# Altium project SewingAutoExt.PrjPcb
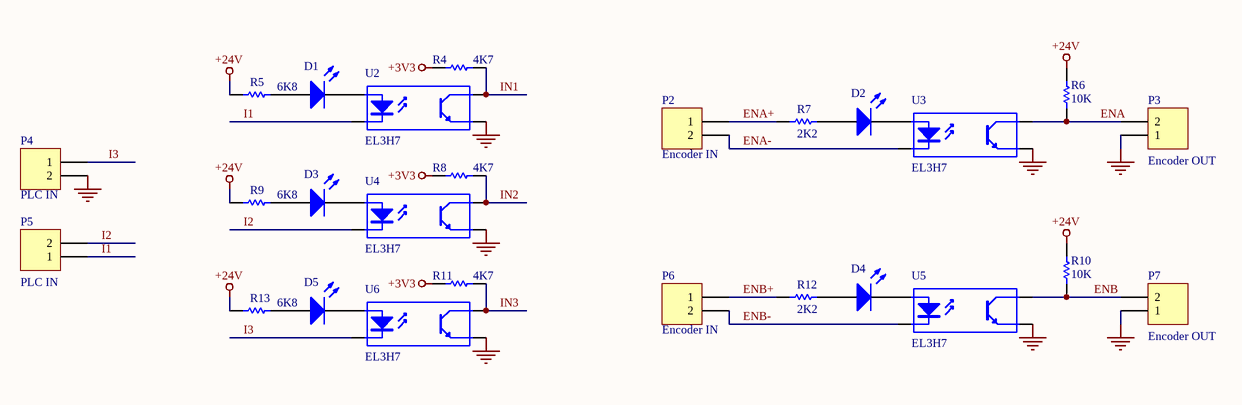
[diagram p0: InputLevelShifter.SchDoc]
4 sheets, 58 parts. Net scope: global (net labels, ports and power ports of the same name join across sheets).
Board file: SewingAutoExt.PcbDoc
Sheets:
  InputLevelShifter.SchDoc
  MCU.SchDoc
  PowerSupply.SchDoc
  DACAmplification.SchDoc

## Sheet InputLevelShifter.SchDoc
size A4

### Parts
D1  SMD0805-RED  [LED-0805]  (value not drawn)
D2  SMD0805-RED  [LED-0805]  (value not drawn)
D3  SMD0805-RED  [LED-0805]  (value not drawn)
D4  SMD0805-RED  [LED-0805]  (value not drawn)
D5  SMD0805-RED  [LED-0805]  (value not drawn)
P2  value Encoder IN  [TER-KF128-2P]  (hidden comment: KF128-2P)
P3  value Encoder OUT  [TER-KF128-2P]  (hidden comment: KF128-2P)
P4  value PLC IN  [TER-KF128-2P]  (hidden comment: KF128-2P)
P5  value PLC IN  [TER-KF128-2P]  (hidden comment: KF128-2P)
P6  value Encoder IN  [TER-KF128-2P]  (hidden comment: KF128-2P)
P7  value Encoder OUT  [TER-KF128-2P]  (hidden comment: KF128-2P)
R4  4K7  [R-0805]
R5  6K8  [R-0805]
R6  10K  [R-0805]
R7  2K2  [R-0805]
R8  4K7  [R-0805]
R9  6K8  [R-0805]
R10  10K  [R-0805]
R11  4K7  [R-0805]
R12  2K2  [R-0805]
R13  6K8  [R-0805]
U2  EL3H7  [SSOP-4]
U3  EL3H7  [SSOP-4]
U4  EL3H7  [SSOP-4]
U5  EL3H7  [SSOP-4]
U6  EL3H7  [SSOP-4]

### Nets
+3V3: R4.2 R8.2 R11.2
+24V: R5.1 R6.2 R9.1 R10.2 R13.1
GND: P3.1 P4.2 P7.1 U2.3(E) U3.3(E) U4.3(E) U5.3(E) U6.3(E)
ENA: P3.2 R6.1 U3.4(C)
ENA+: P2.1 R7.1
ENA-: P2.2 U3.2(K)
ENB: P7.2 R10.1 U5.4(C)
ENB+: P6.1 R12.1
ENB-: P6.2 U5.2(K)
I1: P5.1 U2.2(K)
I2: P5.2 U4.2(K)
I3: P4.1 U6.2(K)
IN1: R4.1 U2.4(C)
IN2: R8.1 U4.4(C)
IN3: R11.1 U6.4(C)
NetD1_1: D1.1(A) R5.2
NetD1_2: D1.2(K) U2.1(A)
NetD2_1: D2.1(A) R7.2
NetD2_2: D2.2(K) U3.1(A)
NetD3_1: D3.1(A) R9.2
NetD3_2: D3.2(K) U4.1(A)
NetD4_1: D4.1(A) R12.2
NetD4_2: D4.2(K) U5.1(A)
NetD5_1: D5.1(A) R13.2
NetD5_2: D5.2(K) U6.1(A)

### Library data of the parts
D1-D5 = LED0: Typical INFRARED GaAs LED; Value: StatusLed; Published: 8-Jun-2000; LatestRevisionDate: 08-Jul-2005; LatestRevisionNote: Mech Layer 1 removed.; PackageReference: LED-0
P2-P7 = Header 2: Header, 2-Pin; LatestRevisionDate: 17-Jul-2002; LatestRevisionNote: Re-released for DXP Platform.
R4-R13 = Res1: Resistor; Published: 8-Jun-2000; LatestRevisionDate: 17-Jul-2002; LatestRevisionNote: Re-released for DXP Platform.; PackageReference: AXIAL-0.3; Publisher: Altium Limited; PackageDescription: Axial Device, Thru-Hole; 2 Leads; 0.3 in Pin Spacing
  R4 R8 R11: Value: 4K7
  R5 R9 R13: Value: 6K8
  R6 R10: Value: 10K
  R7 R12: Value: 2K2
U2-U6 = Optoisolator1: 4-Pin Phototransistor Optocoupler; Published: 24-Mar-1999; LatestRevisionDate: 04-Mar-2005; LatestRevisionNote: Sch pins 3 & 4 Swapped.; DatasheetDocument: Nov-2003; PackageReference: DIP-4; Value: EL3H7

## Sheet MCU.SchDoc
size A4
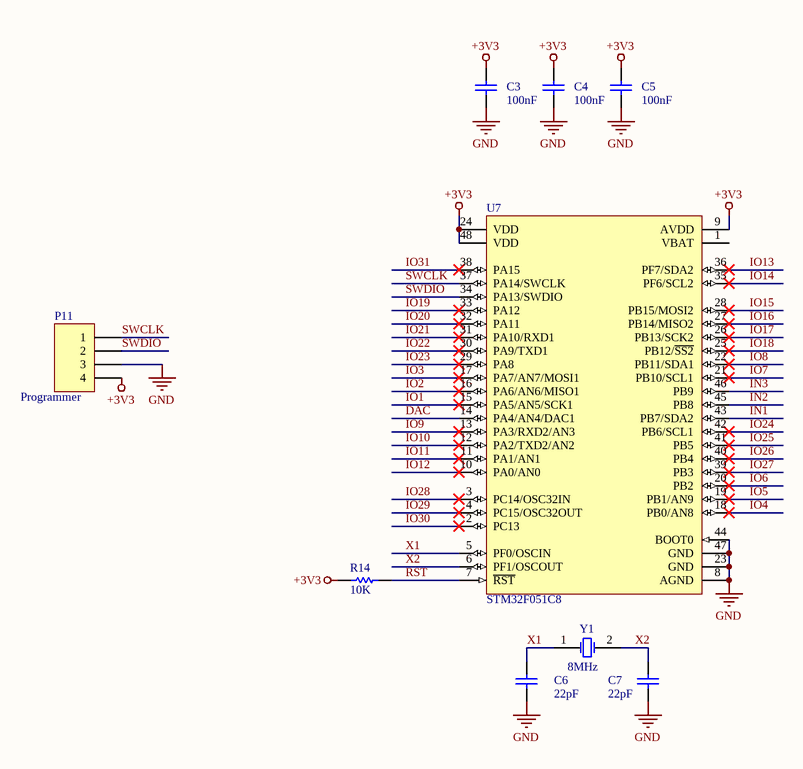
[diagram p1: MCU.SchDoc]

### Parts
C3  value 100nF  [C-0805]  (hidden comment: 104)
C4  value 100nF  [C-0805]  (hidden comment: 104)
C5  value 100nF  [C-0805]  (hidden comment: 104)
C6  value 22pF  [C-0805]  (hidden comment: 22)
C7  value 22pF  [C-0805]  (hidden comment: 22)
P11  value Programmer  [JP2.54-M-1x04A]  (hidden comment: JP2.54-M-4P)
R14  10K  [R-0805]
U7  STM32F051C8  [LQFP-48]
Y1  8MHz  [XTAL-49S]

### Nets
+3V3: C3.1 C4.1 C5.1 P11.4 R14.2 U7.9(AVDD) U7.24(VDD) U7.48(VDD)
GND: C3.2 C4.2 C5.2 C6.1 C7.1 P11.3 U7.8(AGND) U7.23(GND) U7.44(BOOT0) U7.47(GND)
DAC: U7.14(PA4/AN4/DAC1)
IN1: U7.43(PB7/SDA2)
IN2: U7.45(PB8)
IN3: U7.46(PB9)
IO1: U7.15(PA5/AN5/SCK1)
IO2: U7.16(PA6/AN6/MISO1)
IO3: U7.17(PA7/AN7/MOSI1)
IO4: U7.18(PB0/AN8)
IO5: U7.19(PB1/AN9)
IO6: U7.20(PB2)
IO7: U7.21(PB10/SCL1)
IO8: U7.22(PB11/SDA1)
IO9: U7.13(PA3/RXD2/AN3)
IO10: U7.12(PA2/TXD2/AN2)
IO11: U7.11(PA1/AN1)
IO12: U7.10(PA0/AN0)
IO13: U7.36(PF7/SDA2)
IO14: U7.35(PF6/SCL2)
IO15: U7.28(PB15/MOSI2)
IO16: U7.27(PB14/MISO2)
IO17: U7.26(PB13/SCK2)
IO18: U7.25(PB12/~{SS2})
IO19: U7.33(PA12)
IO20: U7.32(PA11)
IO21: U7.31(PA10/RXD1)
IO22: U7.30(PA9/TXD1)
IO23: U7.29(PA8)
IO24: U7.42(PB6/SCL1)
IO25: U7.41(PB5)
IO26: U7.40(PB4)
IO27: U7.39(PB3)
IO28: U7.3(PC14/OSC32IN)
IO29: U7.4(PC15/OSC32OUT)
IO30: U7.2(PC13)
IO31: U7.38(PA15)
RST: R14.1 U7.7(~{RST})
SWCLK: P11.1 U7.37(PA14/SWCLK)
SWDIO: P11.2 U7.34(PA13/SWDIO)
X1: C6.2 U7.5(PF0/OSCIN) Y1.1(OSC1)
X2: C7.2 U7.6(PF1/OSCOUT) Y1.2(OSC2)

Not connected (* = marked no-connect by the designer): U7 1(VBAT)

### Library data of the parts
C3-C7 = Cap: Capacitor; Published: 8-Jun-2000; LatestRevisionDate: 17-Jul-2002; LatestRevisionNote: Re-released for DXP Platform.; PackageReference: RAD-0.3; Publisher: Altium Limited
  C6 C7: PackageDescription: Radial Cap, Thru-Hole; 2 Leads; 0.3 in Pin Spacing
P11 = Header 4: Header, 4-Pin; LatestRevisionDate: 17-Jul-2002; LatestRevisionNote: Re-released for DXP Platform.
R14 = Res1: Resistor; Published: 8-Jun-2000; LatestRevisionDate: 17-Jul-2002; LatestRevisionNote: Re-released for DXP Platform.; PackageReference: AXIAL-0.3; Publisher: Altium Limited; PackageDescription: Axial Device, Thru-Hole; 2 Leads; 0.3 in Pin Spacing; Value: 10K
U7 = STM32F051C8: Core: ARM® 32-bit Cortex® -M0 CPU, frequency up to 48 MHz; Value: STM32F051C8
Y1 = XTAL: Crystal Oscillator; Published: 8-Jun-2000; LatestRevisionDate: 17-Jul-2002; LatestRevisionNote: Re-released for DXP Platform.; PackageReference: R38; Value: 8MHz; PackageDescription: Crystal, Thru-Hole; 2 Leads; Body 3.1 x 8.2 mm (Dia.xH)

## Sheet PowerSupply.SchDoc
size A4
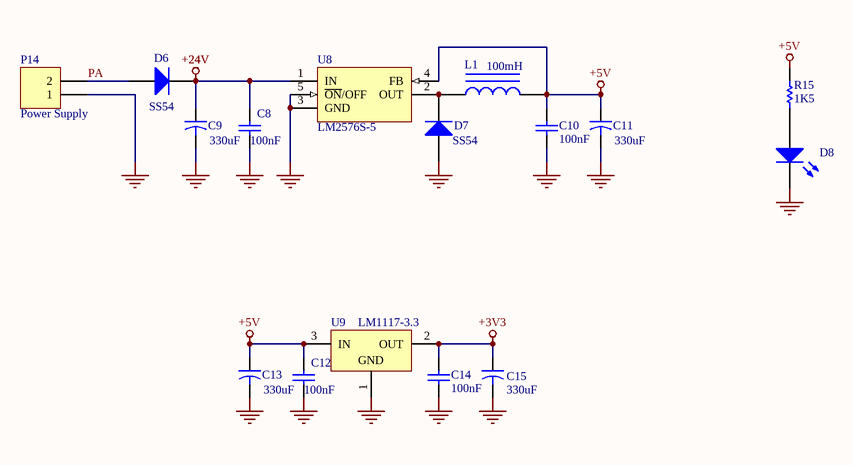
[diagram p2: PowerSupply.SchDoc]

### Parts
C8  value 100nF  [C-0805]  (hidden comment: 104)
C9  value 330uF  [C-ALU-10x10.2mm]  (hidden comment: 330uF/50V)
C10  value 100nF  [C-0805]  (hidden comment: 104)
C11  value 330uF  [C-ALU-10x10.2mm]  (hidden comment: 330uF/50V)
C12  value 100nF  [C-0805]  (hidden comment: 104)
C13  value 330uF  [C-ALU-10x10.2mm]  (hidden comment: 330uF/50V)
C14  value 100nF  [C-0805]  (hidden comment: 104)
C15  value 330uF  [C-ALU-10x10.2mm]  (hidden comment: 330uF/50V)
D6  value SS54  [D-DO214-AB]  (hidden comment: SS54-SMA)
D7  value SS54  [D-DO214-AB]  (hidden comment: SS54-SMA)
D8  SMD0805-RED  [LED-0805]  (value not drawn)
L1  value 100mH  [L-SMD-12.5x12.5]  (hidden comment: 100mH/3A)
P14  value Power Supply  [TER-KF128-2P]  (hidden comment: KF128-2P)
R15  1K5  [R-0805]
U8  LM2576S-5  [TO-263-5L]
U9  LM1117-3.3  [SOT-223-3]

### Nets
+3V3: C14.1 C15.1 U9.2(OUT)
+5V: C10.1 C11.1 C12.1 C13.1 L1.2 R15.2 U8.4(FB) U9.3(IN)
+24V: C8.1 C9.1 D6.2(K) U8.1(IN)
GND: C8.2 C9.2 C10.2 C11.2 C12.2 C13.2 C14.2 C15.2 D7.1(A) D8.2(K) P14.1 U8.3(GND) U8.5(~{ON}/OFF) U8.HM U9.1(GND)
PA: D6.1(A) P14.2
NetD7_2: D7.2(K) L1.1 U8.2(OUT)
NetD8_1: D8.1(A) R15.1

### Library data of the parts
C8 C10 C12 C14 = Cap: Capacitor; Published: 8-Jun-2000; LatestRevisionDate: 17-Jul-2002; LatestRevisionNote: Re-released for DXP Platform.; PackageReference: RAD-0.3; Publisher: Altium Limited
C9 C11 C13 C15 = Cap2: 100UF 50V 10x10.2MM; Published: 23-Sep-2002; PackageReference: CAPR5-4X5; Publisher: Altium Limited
D6 D7 = Diode 1N4004: 1 Amp General Purpose Rectifier; Published: 8-Jun-2000; LatestRevisionDate: 17-Jul-2002; LatestRevisionNote: Re-released for DXP Platform.; DatasheetDocument: 1998; PackageDocument: Aug-1999; PackageReference: DO-41; Code_JEDEC: DO-204-AL; ComponentLink1Description: Manufacturer Link; ComponentLink1URL: http://www.fairchildsemi.com/; ComponentLink2Description: Datasheet; ComponentLink2URL: http://www.fairchildsemi.com/ds/1N%2F1N4001.pdf
D8 = LED0: Typical INFRARED GaAs LED; Value: PowerLed; Published: 8-Jun-2000; LatestRevisionDate: 08-Jul-2005; LatestRevisionNote: Mech Layer 1 removed.; PackageReference: LED-0
L1 = Inductor Iron: Magnetic-Core Inductor; Published: 24-Mar-1999; LatestRevisionDate: 17-Jul-2002; LatestRevisionNote: Re-released for DXP Platform.; PackageReference: AXIAL-0.9; Publisher: Altium Limited; PackageDescription: Axial Device, Thru-Hole; 2 Leads; 0.9 in Pin Spacing
P14 = Header 2: Header, 2-Pin; LatestRevisionDate: 17-Jul-2002; LatestRevisionNote: Re-released for DXP Platform.
R15 = Res1: Resistor; Published: 8-Jun-2000; LatestRevisionDate: 17-Jul-2002; LatestRevisionNote: Re-released for DXP Platform.; PackageReference: AXIAL-0.3; Publisher: Altium Limited; PackageDescription: Axial Device, Thru-Hole; 2 Leads; 0.3 in Pin Spacing; Value: 1K5
U8 = LM2576S-5.0: Simple Switcher 3A Step Down Voltage Regulator; Note: Tab is connected to GND; Published: 15-Apr-2002; DatasheetVersion: Jun-1999; PackageReference: TS5B; Publisher: Altium Limited; PackageDescription: D2-PAK; 5 Leads; Body 14.4 (inc. leads) x 10.4 mm (LxW max); ComponentLink1Description: Manufacturer Link; ComponentLink1URL: http://www.national.com/; ComponentLink2Description: Datasheet; ComponentLink2URL: http://www.national.com/ds.cgi/LM/LM2576.pdf; ComponentLink3Description: URL Link1; ComponentLink3URL: http://www.national.com/pf/LM/LM2576.html
U9 = LM1117DT-3.3: 800mA Low-Dropout Linear Regulator, 3-pin TO-252; Manufacturer: National Semiconductor; PackageTopMarking: NSUZXYTT*LM1117*DT-3.3; PowerWise: N; CompType: LDO IC; Published: 4-Dec-2008; DatasheetVersion: Apr-2006; PackageVersion: revD, Feb-2009; PackageReference: TD03B; Publisher: Altium Limited; PackageDescription: TO252, Molded, Jedec, 6.8 x 6.10 x 2.30mm Body, 3 Lead, 2.28mm Pitch, Surface Mount; Supplier 1: Farnell; Supplier Part Number 1: 9486275; Supplier 2: Farnell; Supplier Part Number 2: 1523829; PartNumber: LM1117DT-3.3; RoHS: N; PinCount: 3; Code_JEDEC: TO-252-AA; ComponentLink1Description: LM1117 Datasheet; ComponentLink1URL: http://www.national.com/ds/LM/LM1117.pdf; ComponentLink2Description: LM1117 Web Page; ComponentLink2URL: http://www.national.com/pf/LM/LM1117.html; ComponentLink3Description: TD03B Package Page; ComponentLink3URL: http://www.national.com/packaging/folders/td03b.html; Value: LM1117-3.3

## Sheet DACAmplification.SchDoc: ExtModule-SewingController
size A4
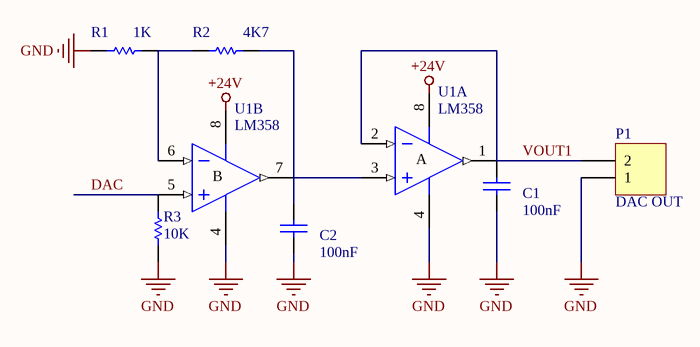
[diagram p3: DACAmplification.SchDoc]

### Parts
C1  value 100nF  [C-0805]  (hidden comment: 104)
C2  value 100nF  [C-0805]  (hidden comment: 104)
P1  value DAC OUT  [TER-KF128-2P]  (hidden comment: KF128-2P)
R1  1K  [R-0805]
R2  4K7  [R-0805]
R3  10K  [R-0805]
U1  LM358  [SK-DIP8-300]  (parts A,B of 2)

### Nets
+24V: U1.8(V+)
GND: C1.1 C2.1 P1.1 R1.1 R3.1 U1.4(V-)
DAC: R3.2 U1.5(IN+)
VOUT1: C1.2 P1.2 U1.1(OUT) U1.2(IN-)
NetC2_2: C2.2 R2.2 U1.3(IN+) U1.7(OUT)
NetR1_2: R1.2 R2.1 U1.6(IN-)

### Notes on the sheet
- (in symbol TL082D, part A) A
- (in symbol TL082D, part B) B

### Library data of the parts
C1 C2 = Cap: Capacitor; Published: 8-Jun-2000; LatestRevisionDate: 17-Jul-2002; LatestRevisionNote: Re-released for DXP Platform.; PackageReference: RAD-0.3; Publisher: Altium Limited; PackageDescription: Radial Cap, Thru-Hole; 2 Leads; 0.3 in Pin Spacing
P1 = Header 2: Header, 2-Pin; LatestRevisionDate: 17-Jul-2002; LatestRevisionNote: Re-released for DXP Platform.
R1-R3 = Res1: Resistor; Published: 8-Jun-2000; LatestRevisionDate: 17-Jul-2002; LatestRevisionNote: Re-released for DXP Platform.; PackageReference: AXIAL-0.3; Publisher: Altium Limited; PackageDescription: Axial Device, Thru-Hole; 2 Leads; 0.3 in Pin Spacing
  R1: Value: 1K
  R2: Value: 4K7
  R3: Value: 10K
U1 = TL082D: JFET-Input Operational Amplifier; Value: TL082; Published: 16-Jan-2001; LatestRevisionDate: 13-Apr-2006; LatestRevisionNote: IPC-7351 Footprint Added.; DatasheetVersion: Feb-1999; PackageVersion: Jan-1998; PackageReference: D008; PackageDescription: 8-Pin Small Outline Integrated Circuit 1.27 mm Pitch; Code_IPC: SOIC127P600-8; ComponentLink1Description: Manufacturer Link; ComponentLink1URL: http://www.ti.com/; ComponentLink2Description: Datasheet; ComponentLink2URL: http://www-s.ti.com/sc/ds/tl082.pdf

## Nets that join several sheets
+3V3: InputLevelShifter (R4.2 R8.2 R11.2), MCU (8 pins), PowerSupply (C14.1 C15.1 U9.2)
+24V: InputLevelShifter (5 pins), PowerSupply (C8.1 C9.1 D6.2 U8.1), DACAmplification (U1.8)
GND: InputLevelShifter (8 pins), MCU (10 pins), PowerSupply (15 pins), DACAmplification (6 pins)
DAC: MCU (U7.14), DACAmplification (R3.2 U1.5)
IN1: InputLevelShifter (R4.1 U2.4), MCU (U7.43)
IN2: InputLevelShifter (R8.1 U4.4), MCU (U7.45)
IN3: InputLevelShifter (R11.1 U6.4), MCU (U7.46)